# Altium schematic sheet block_v9.SchDoc: mcHF QRP Transceiver
size A4; Author: Krassi A; CompanyName: M0NKA; Revision: 0.6.4; SheetTotal: 1
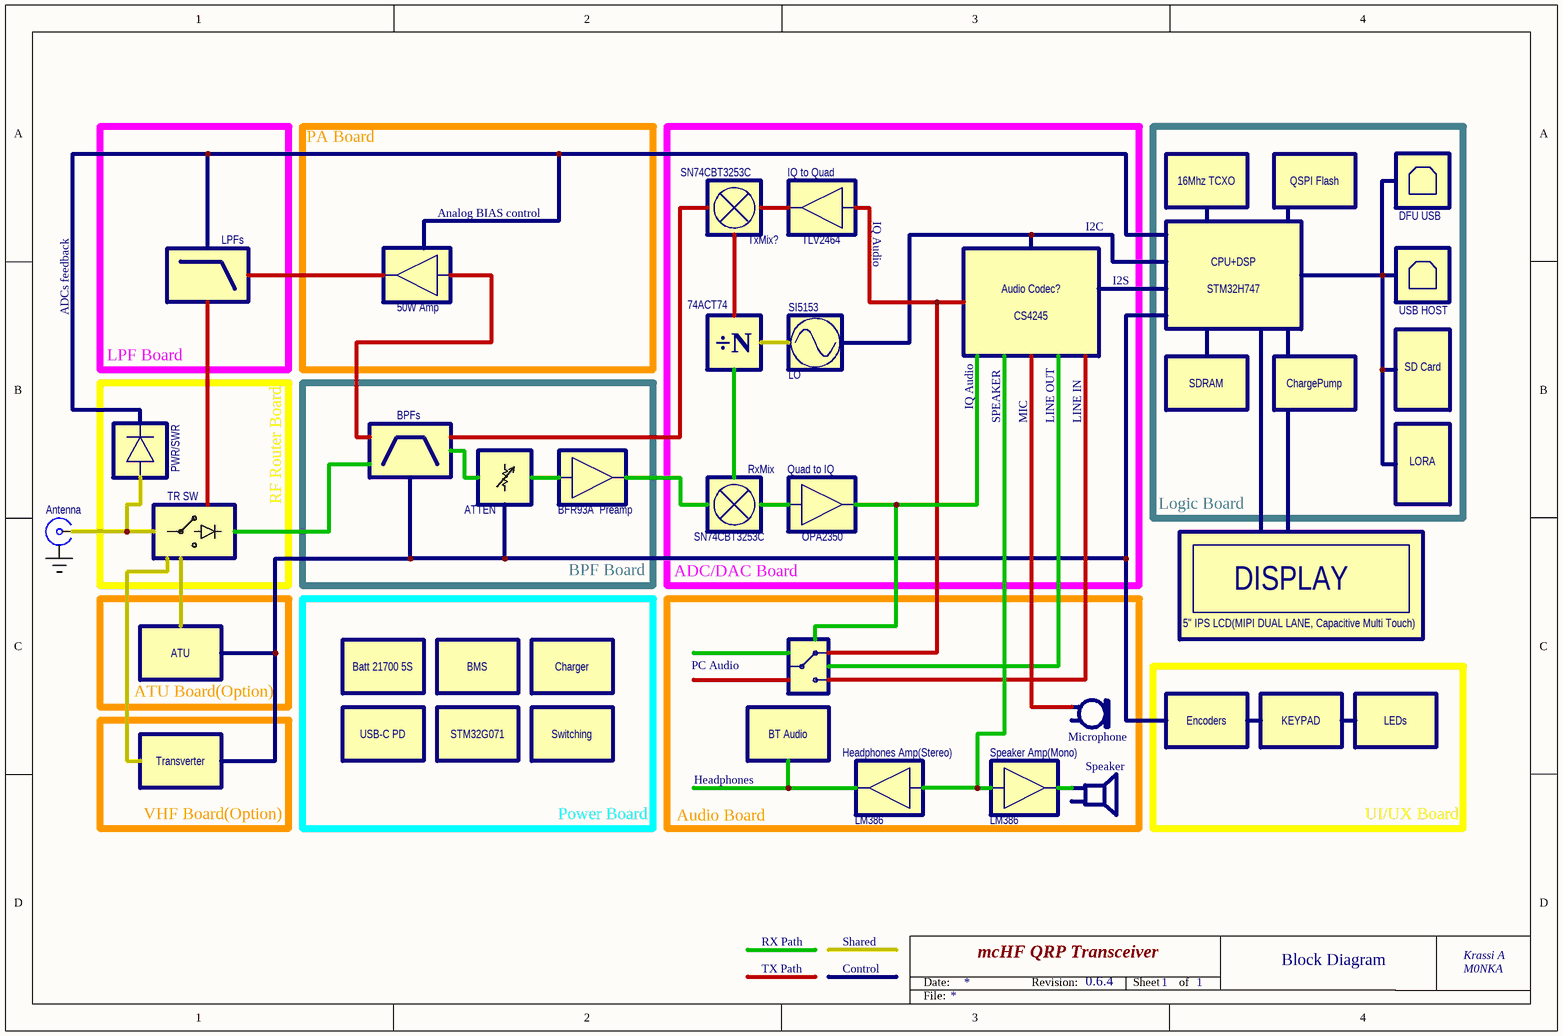
[diagram p0: block_v9.SchDoc]

## Parts
5"_IPS_LCD(MIPI_DUAL_LANE,_Capacitive_Multi_Touch)  DISPLAY  (value not drawn)
16Mhz_TCXO  BLK-SM  (value not drawn)
50W_Amp  AMP  (value not drawn)
Antenna  CON-RF  (value not drawn)
ATU  BLK-SM  (value not drawn)
Audio_Codec?  CS4245
Audio_SW?  SW-SPDT  (value not drawn)
Batt_21700_5S  BLK-SM  (value not drawn)
BMS  BLK-SM  (value not drawn)
BPFs  FILTER-BP  (value not drawn)
BT_Audio  BLK-SM  (value not drawn)
ChargePump  BLK-SM  (value not drawn)
Charger  BLK-SM  (value not drawn)
DFU_USB  CON-USB  (value not drawn)
Encoders  BLK-SM  (value not drawn)
Headphones_Amp(Stereo)  LM386
IQ_to_Quad  TLV2464
KEYPAD  BLK-SM  (value not drawn)
LEDs  BLK-SM  (value not drawn)
LORA  BLK-SM  (value not drawn)
LPFs  FILTER-LP  (value not drawn)
Microphone  Mic2  [PIN2]  (value not drawn)
Preamp  BFR93A
PWR/SWR  DET-POWER  (value not drawn)
QSPI_Flash  BLK-SM  (value not drawn)
Quad_to_IQ  OPA2350
R?  ATTEN
RxMix  SN74CBT3253C
SD_Card  BLK-SM  (value not drawn)
SDRAM  BLK-SM  (value not drawn)
SI5153  LO
Speaker  Speaker  [PIN2]  (value not drawn)
Speaker_Amp(Mono)  LM386
STM32G071  BLK-SM  (value not drawn)
STM32H747  CPU+DSP
Switching  BLK-SM  (value not drawn)
TR_SW  TR SW  (value not drawn)
Transverter  BLK-SM  (value not drawn)
Tx_Quad_Clk?  74ACT74
TxMix?  SN74CBT3253C
USB-C_PD  BLK-SM  (value not drawn)
USB_HOST  CON-USB  (value not drawn)

## Blocks framed on the sheet
PA Board: 50W_Amp
ADC/DAC Board: Audio_Codec? IQ_to_Quad Quad_to_IQ RxMix SI5153 Tx_Quad_Clk? TxMix?
Logic Board: 16Mhz_TCXO ChargePump DFU_USB LORA QSPI_Flash SD_Card SDRAM STM32H747 USB_HOST
LPF Board: PWR/SWR TR_SW
BPF Board: BPFs Preamp R?
ATU Board(Option): ATU
Power Board: Batt_21700_5S BMS Charger STM32G071 Switching USB-C_PD
UI/UX Board: Encoders KEYPAD LEDs
VHF Board(Option): Transverter

## Notes on the sheet
- Analog BIAS control
- (near IQ_to_Quad) IQ Audio
- I2C
- ADCs feedback
- I2S
- IQ Audio
- SPEAKER
- MIC
- LINE OUT
- LINE IN
- RF Router Board
- (near Audio_SW?) PC Audio
- (near BT_Audio) Headphones
- Audio Board
- RX Path
- TX Path
- Control
- Shared
- 1
- Block Diagram
- Date:
- Revision:
- Sheet
- of
- File:
- (in symbol DIVIDER) ÷N

## Library data of the parts
Audio_Codec? STM32H747 = BLK-LG
Headphones_Amp(Stereo) IQ_to_Quad Preamp Quad_to_IQ Speaker_Amp(Mono) = AMP
Microphone = Mic2: Microphone; Published: 24-Mar-1999; LatestRevisionDate: 17-Jul-2002; LatestRevisionNote: Re-released for DXP Platform.; PackageReference: PIN2; Publisher: Altium Limited
R? = ATTEN-VAR
RxMix TxMix? = MIXER
SI5153 = VCO
Speaker = Speaker: Loudspeaker; Published: 24-Mar-1999; LatestRevisionDate: 17-Jul-2002; LatestRevisionNote: Re-released for DXP Platform.; PackageReference: PIN2; Publisher: Altium Limited
Tx_Quad_Clk? = DIVIDER